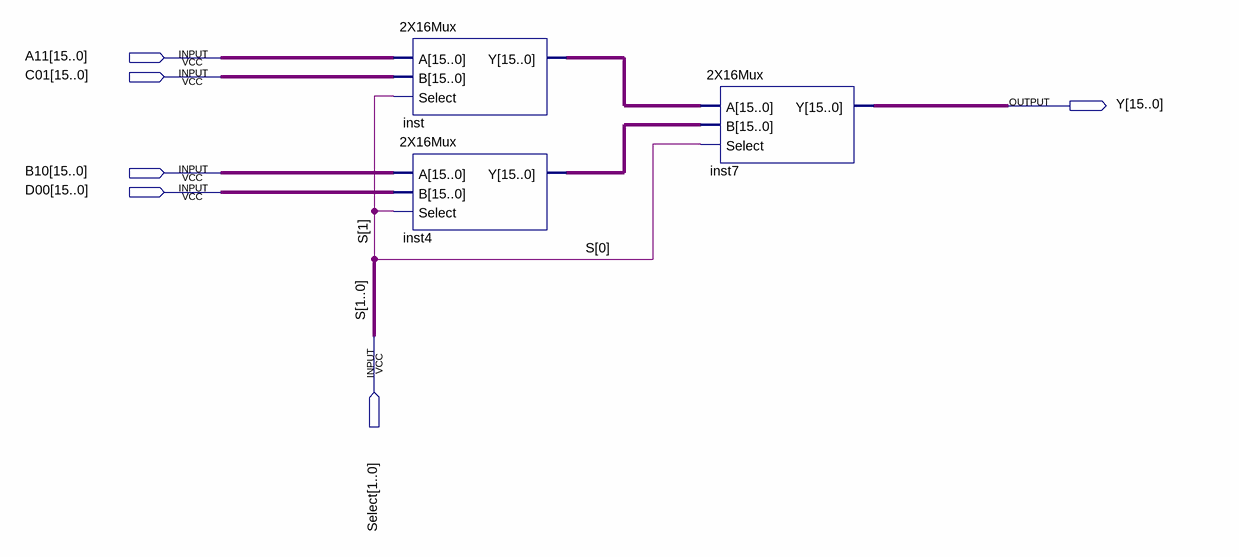
[diagram p0: schematic sheet]
// Quartus schematic 4x16Mux.bdf as structural Verilog: 3 symbols, 6 pins
module \4x16Mux  (
  input  [15:0] A11,
  input  [15:0] C01,
  input  [15:0] B10,
  input  [15:0] D00,
  input  [1:0] Select,
  output [15:0] Y
);

  wire [15:0] inst4_y, inst_y;

  \2X16Mux  inst (.A(A11), .B(C01), .Select(Select[1]), .Y(inst_y));
  \2X16Mux  inst4 (.A(B10), .B(D00), .Select(Select[1]), .Y(inst4_y));
  \2X16Mux  inst7 (.A(inst_y), .B(inst4_y), .Select(Select[0]), .Y(Y));

  // Other names for the same wires on the sheet: S[1:0] = Select
endmodule
